# Altium project PCB_Project.PrjPcb
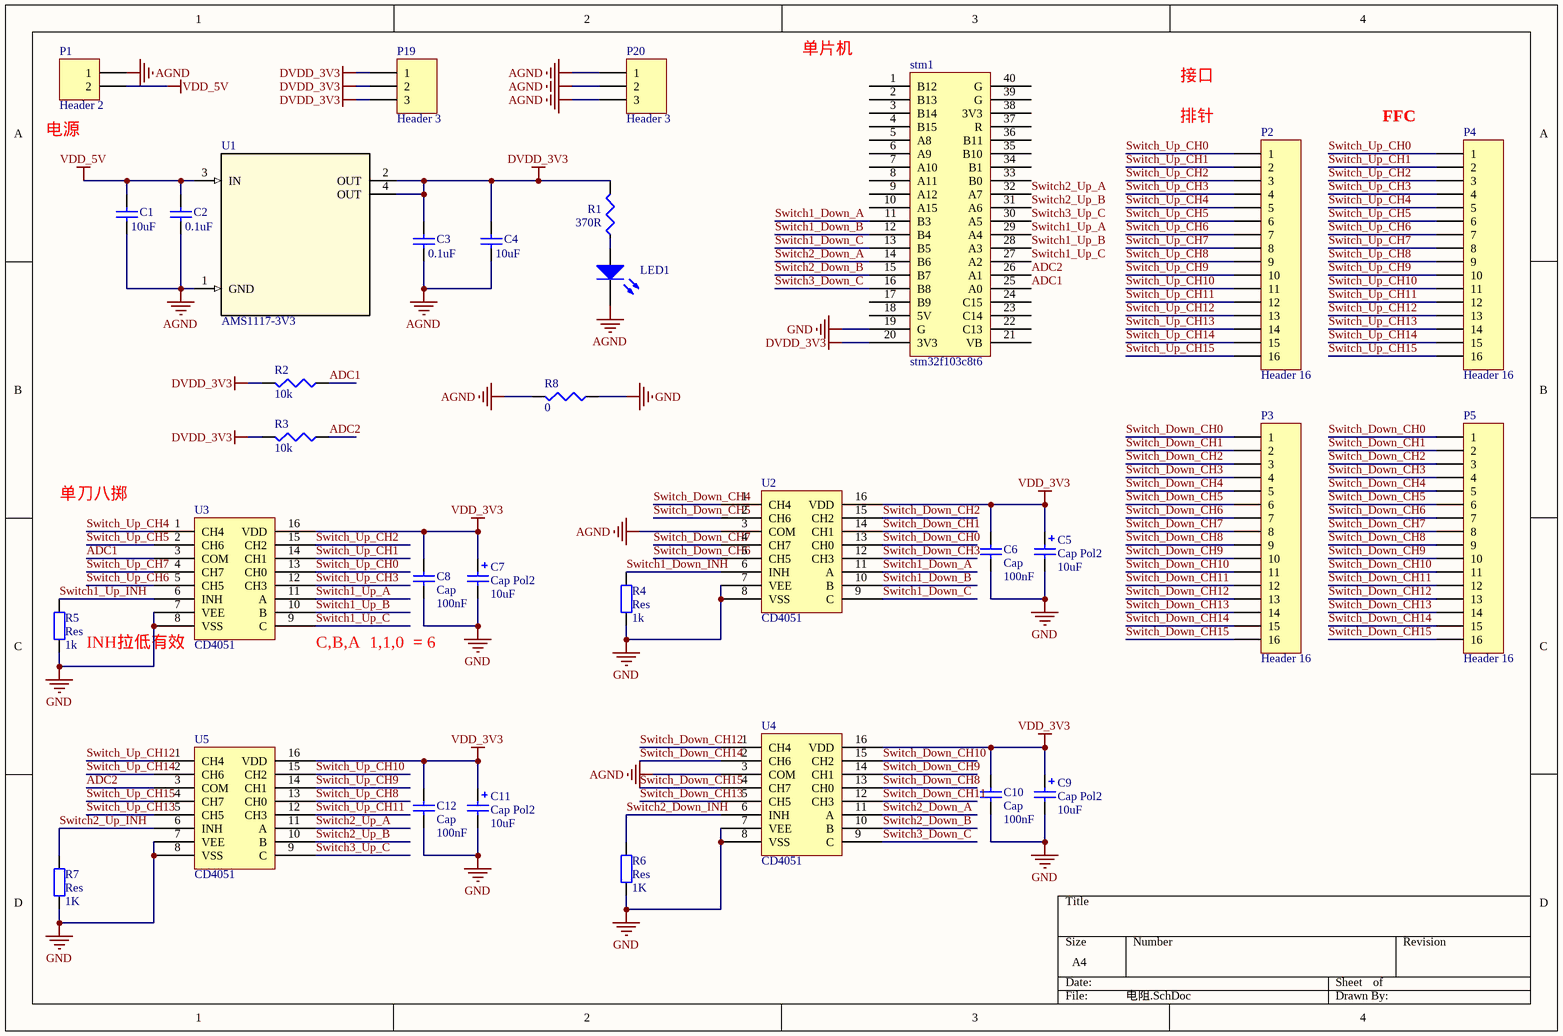
[diagram p0: 电阻.SchDoc]
1 sheet, 34 parts. Net scope: global (net labels, ports and power ports of the same name join across sheets).
Board file: PCB1.PcbDoc

## Sheet 电阻.SchDoc
size A4

### Parts
C1  value 10uF  [C-0603]
C2  value 0.1uF  [C-0603]
C3  value 0.1uF  [C-0603]
C4  value 10uF  [C-0603]
C5  Cap Pol2  value 10uF  [Cap-TA]
C6  Cap  value 100nF  [0805C]
C7  Cap Pol2  value 10uF  [Cap-TA]
C8  Cap  value 100nF  [0805C]
C9  Cap Pol2  value 10uF  [Cap-TA]
C10  Cap  value 100nF  [0805C]
C11  Cap Pol2  value 10uF  [Cap-TA]
C12  Cap  value 100nF  [0805C]
LED1  (no value)  [CLED1608-0603]
P1  Header 2  [XH2.54-LI-2P]
P2  Header 16  [HDR1X16]
P3  Header 16  [HDR1X16]
P4  Header 16  [ffc_1mm]
P5  Header 16  [ffc_1mm]
P19  Header 3  [HDR1X3]
P20  Header 3  [HDR1X3]
R1  value 370R  [R-0603]  (hidden comment: Res3)
R2  value 10k  [R-0603]  (hidden comment: Res3)
R3  value 10k  [R-0603]  (hidden comment: Res3)
R4  Res  value 1k  [0805R]
R5  Res  value 1k  [0805R]
R6  Res  value 1K  [0805R]
R7  Res  value 1K  [0805R]
R8  value 0  [R-0603]  (hidden comment: Res3)
stm1  stm32f103c8t6  [PCBComponent_1]
U1  AMS1117-3V3  [LM317]
U2  CD4051  [SO16]
U3  CD4051  [SO16]
U4  CD4051  [SO16]
U5  CD4051  [SO16]

### Nets
AGND: C1.1 C2.1 C3.1 C4.1 LED1.2(K) P1.1 P20.1 P20.2 P20.3 R8.2 U1.1(GND) U2.3(COM) U4.3(COM)
DVDD_3V3: C3.2 C4.2 P19.1 P19.2 P19.3 R1.2 R2.2 R3.2 stm1.20(3V3) U1.2(OUT) U1.4(OUT)
GND: C5.2 C6.1 C7.2 C8.1 C9.2 C10.1 C11.2 C12.1 R4.1 R5.1 R6.1 R7.1 R8.1 stm1.19(G) U2.7(VEE) U2.8(VSS) U3.7(VEE) U3.8(VSS) U4.7(VEE) U4.8(VSS) U5.7(VEE) U5.8(VSS)
VDD_3V3: C5.1 C6.2 C7.1 C8.2 C9.1 C10.2 C11.1 C12.2 U2.16(VDD) U3.16(VDD) U4.16(VDD) U5.16(VDD)
VDD_5V: C1.2 C2.2 P1.2 U1.3(IN)
ADC1: R2.1 stm1.25(A0) U3.3(COM)
ADC2: R3.1 stm1.26(A1) U5.3(COM)
Switch1_Down_A: stm1.11(B3) U2.11(A)
Switch1_Down_B: stm1.12(B4) U2.10(B)
Switch1_Down_C: stm1.13(B5) U2.9(C)
Switch1_Down_INH: R4.2 U2.6(INH)
Switch1_Up_A: stm1.29(A4) U3.11(A)
Switch1_Up_B: stm1.28(A3) U3.10(B)
Switch1_Up_C: stm1.27(A2) U3.9(C)
Switch1_Up_INH: R5.2 U3.6(INH)
Switch2_Down_A: stm1.14(B6) U4.11(A)
Switch2_Down_B: stm1.15(B7) U4.10(B)
Switch2_Down_INH: R6.2 U4.6(INH)
Switch2_Up_A: stm1.32(A7) U5.11(A)
Switch2_Up_B: stm1.31(A6) U5.10(B)
Switch2_Up_INH: R7.2 U5.6(INH)
Switch3_Down_C: stm1.16(B8) U4.9(C)
Switch3_Up_C: stm1.30(A5) U5.9(C)
Switch_Down_CH0: P3.1 P5.1 U2.13(CH0)
Switch_Down_CH1: P3.2 P5.2 U2.14(CH1)
Switch_Down_CH2: P3.3 P5.3 U2.15(CH2)
Switch_Down_CH3: P3.4 P5.4 U2.12(CH3)
Switch_Down_CH4: P3.5 P5.5 U2.1(CH4)
Switch_Down_CH5: P3.6 P5.6 U2.2(CH6)
Switch_Down_CH6: P3.7 P5.7 U2.5(CH5)
Switch_Down_CH7: P3.8 P5.8 U2.4(CH7)
Switch_Down_CH8: P3.9 P5.9 U4.13(CH0)
Switch_Down_CH9: P3.10 P5.10 U4.14(CH1)
Switch_Down_CH10: P3.11 P5.11 U4.15(CH2)
Switch_Down_CH11: P3.12 P5.12 U4.12(CH3)
Switch_Down_CH12: P3.13 P5.13 U4.1(CH4)
Switch_Down_CH13: P3.14 P5.14 U4.5(CH5)
Switch_Down_CH14: P3.15 P5.15 U4.2(CH6)
Switch_Down_CH15: P3.16 P5.16 U4.4(CH7)
Switch_Up_CH0: P2.1 P4.1 U3.13(CH0)
Switch_Up_CH1: P2.2 P4.2 U3.14(CH1)
Switch_Up_CH2: P2.3 P4.3 U3.15(CH2)
Switch_Up_CH3: P2.4 P4.4 U3.12(CH3)
Switch_Up_CH4: P2.5 P4.5 U3.1(CH4)
Switch_Up_CH5: P2.6 P4.6 U3.2(CH6)
Switch_Up_CH6: P2.7 P4.7 U3.5(CH5)
Switch_Up_CH7: P2.8 P4.8 U3.4(CH7)
Switch_Up_CH8: P2.9 P4.9 U5.13(CH0)
Switch_Up_CH9: P2.10 P4.10 U5.14(CH1)
Switch_Up_CH10: P2.11 P4.11 U5.15(CH2)
Switch_Up_CH11: P2.12 P4.12 U5.12(CH3)
Switch_Up_CH12: P2.13 P4.13 U5.1(CH4)
Switch_Up_CH13: P2.14 P4.14 U5.5(CH5)
Switch_Up_CH14: P2.15 P4.15 U5.2(CH6)
Switch_Up_CH15: P2.16 P4.16 U5.4(CH7)
NetLED1_1: LED1.1(A) R1.1

Not connected (* = marked no-connect by the designer): stm1 1(B12) 2(B13) 3(B14) 4(B15) 5(A8) 6(A9) 7(A10) 8(A11) 9(A12) 10(A15) 17(B9) 18(5V) 21(VB) 22(C13) 23(C14) 24(C15) 33(B0) 34(B1) 35(B10) 36(B11) 37(R) 38(3V3) 39(G) 40(G)

### Notes on the sheet
- Labels drawn without touching a wire or pin: C,B,A  1,1,0  = 6, FFC, INH拉低有效, 单刀八掷, 单片机, 排针, 接口, 电源

### Library data of the parts
C1-C4 = Cap Semi: Capacitor (Semiconductor SIM Model); Published: 8-Jun-2000; LatestRevisionDate: 29-May-2009; LatestRevisionNote: IPC-7351 Footprint Added.; PackageReference: C1206; Publisher: Altium Limited; PackageDescription: Chip Capacitor
C5 C7 C9 C11 = Cap Pol2: Polarized Capacitor (Axial); Published: 8-Jun-2000; LatestRevisionDate: 17-Jul-2002; LatestRevisionNote: Re-released for DXP Platform.; PackageReference: POLAR0.8; Publisher: Altium Limited; PackageDescription: Polarized Capacitor; 2 Leads
C6 C8 C10 C12 = Cap: Capacitor; Published: 8-Jun-2000; LatestRevisionDate: 17-Jul-2002; LatestRevisionNote: Re-released for DXP Platform.; PackageReference: RAD-0.3; Publisher: Altium Limited; PackageDescription: Radial Cap, Thru-Hole; 2 Leads; 0.3 in Pin Spacing
LED1 = LED Chip: Typical Chip LED; Published: 8-Jun-2000; Publisher: Altium Limited; Revision: July-2002: Re-released for DXP Platform.
P1 = Header 2: Header, 2-Pin; LatestRevisionDate: 17-Jul-2002; LatestRevisionNote: Re-released for DXP Platform.; Publisher: Altium Limited
P2-P5 = Header 16: Header, 16-Pin; LatestRevisionDate: 17-Jul-2002; LatestRevisionNote: Re-released for DXP Platform.; Publisher: Altium Limited
P19 P20 = Header 3: Header, 3-Pin; LatestRevisionDate: 17-Jul-2002; LatestRevisionNote: Re-released for DXP Platform.; Publisher: Altium Limited
R1-R3 R8 = Res3: Resistor; Published: 8-Jun-2000; LatestRevisionDate: 29-May-2009; LatestRevisionNote: IPC-7351 Footprint Added.; PackageReference: J1-0603; Publisher: Altium Limited; PackageDescription: Chip Resistor
R4-R7 = Res: Resistor; Published: 8-Jun-2000; LatestRevisionDate: 17-Jul-2002; LatestRevisionNote: Re-released for DXP Platform.; PackageReference: AXIAL-0.4; Publisher: Altium Limited; PackageDescription: Axial Device, Thru-Hole; 2 Leads; 0.4 in Pin Spacing
U1 = LM317DCYR: LM317DCYR-SOT223; Manufacturer: Texas Instruments; SymbolCreater: Altium; CompType: IC; PIN_COUNT: 4; PartNumber: LM317DCYR; Alternate_PartNumber: LM317DCY; PackageReference: DCY0004A; MountType: SMT; RoHS: Y; RefDes: RefDes; TYPE: TYPE; Value: Value